# Altium schematic sheet PROC054D_Host_Connector.SchDoc: HOST_CONNECTOR
size 558 x 431 mm; Date: Not shown in title block; ApprovedBy: Not shown in title block; CheckedBy: Not shown in title block; Author: Not shown in title block; CompanyName: Not shown in title block; DrawnBy: a0271760; Engineer: Not shown in title block; Organization: Not shown in title block; Address1: Not shown in title block; Address2: Not shown in title block; Address3: Not shown in title block; Address4: Not shown in title block; DocumentNumber: 9; Revision: Use project pAWRameter SCH_Rev; SheetNumber: 9; SheetTotal: 19; PageSetup: Record=PageOptions|CenterHorizontal=True|CenterVertical=True|PrintScale=1.00|XCorrection=1.00|YCorrection=1.00|PrintKind=0|BorderSize=5000000|LeftOffset=0|BottomOffset=0|Orientation=2|PaperLength=1000|PaperWidth=1000|Scale=100|PaperSource=15|PrintQuality=600|MediaType=1|DitherType=10|PaperKind=Letter|PrintScaleMode=1; CurrentTime: Not shown in title block; CurrentDate: Not shown in title block; Time: Not shown in title block; DocumentFullPathAndName: Not shown in title block; DocumentName: Not shown in title block; ModifiedDate: Not shown in title block; ImagePath: Not shown in title block
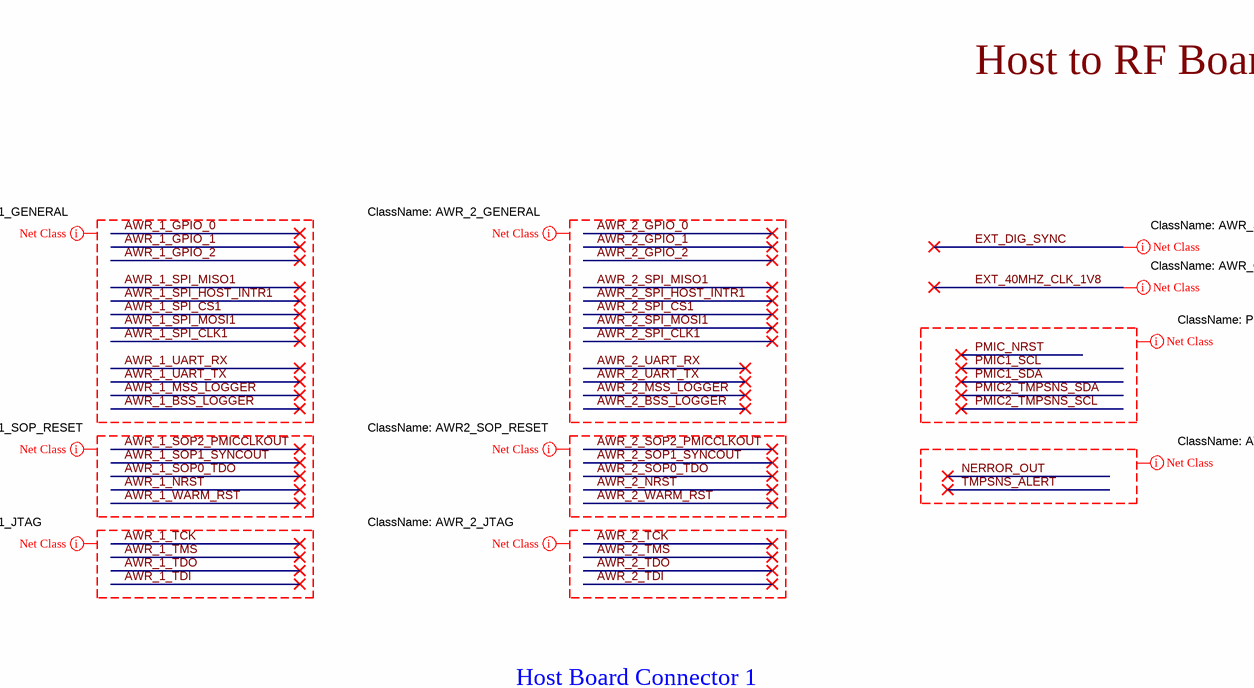
[diagram p0: PROC054D_Host_Connector.SchDoc, top left]
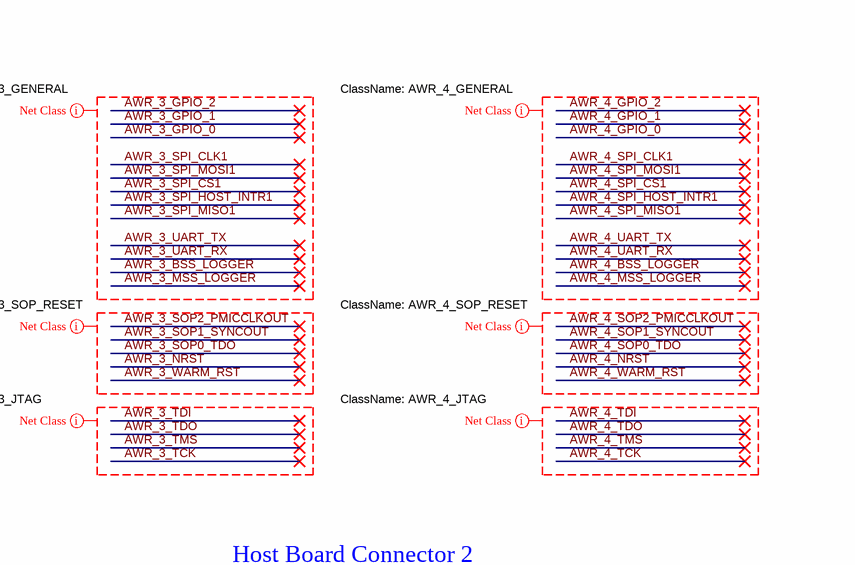
[diagram p1: PROC054D_Host_Connector.SchDoc, top right]
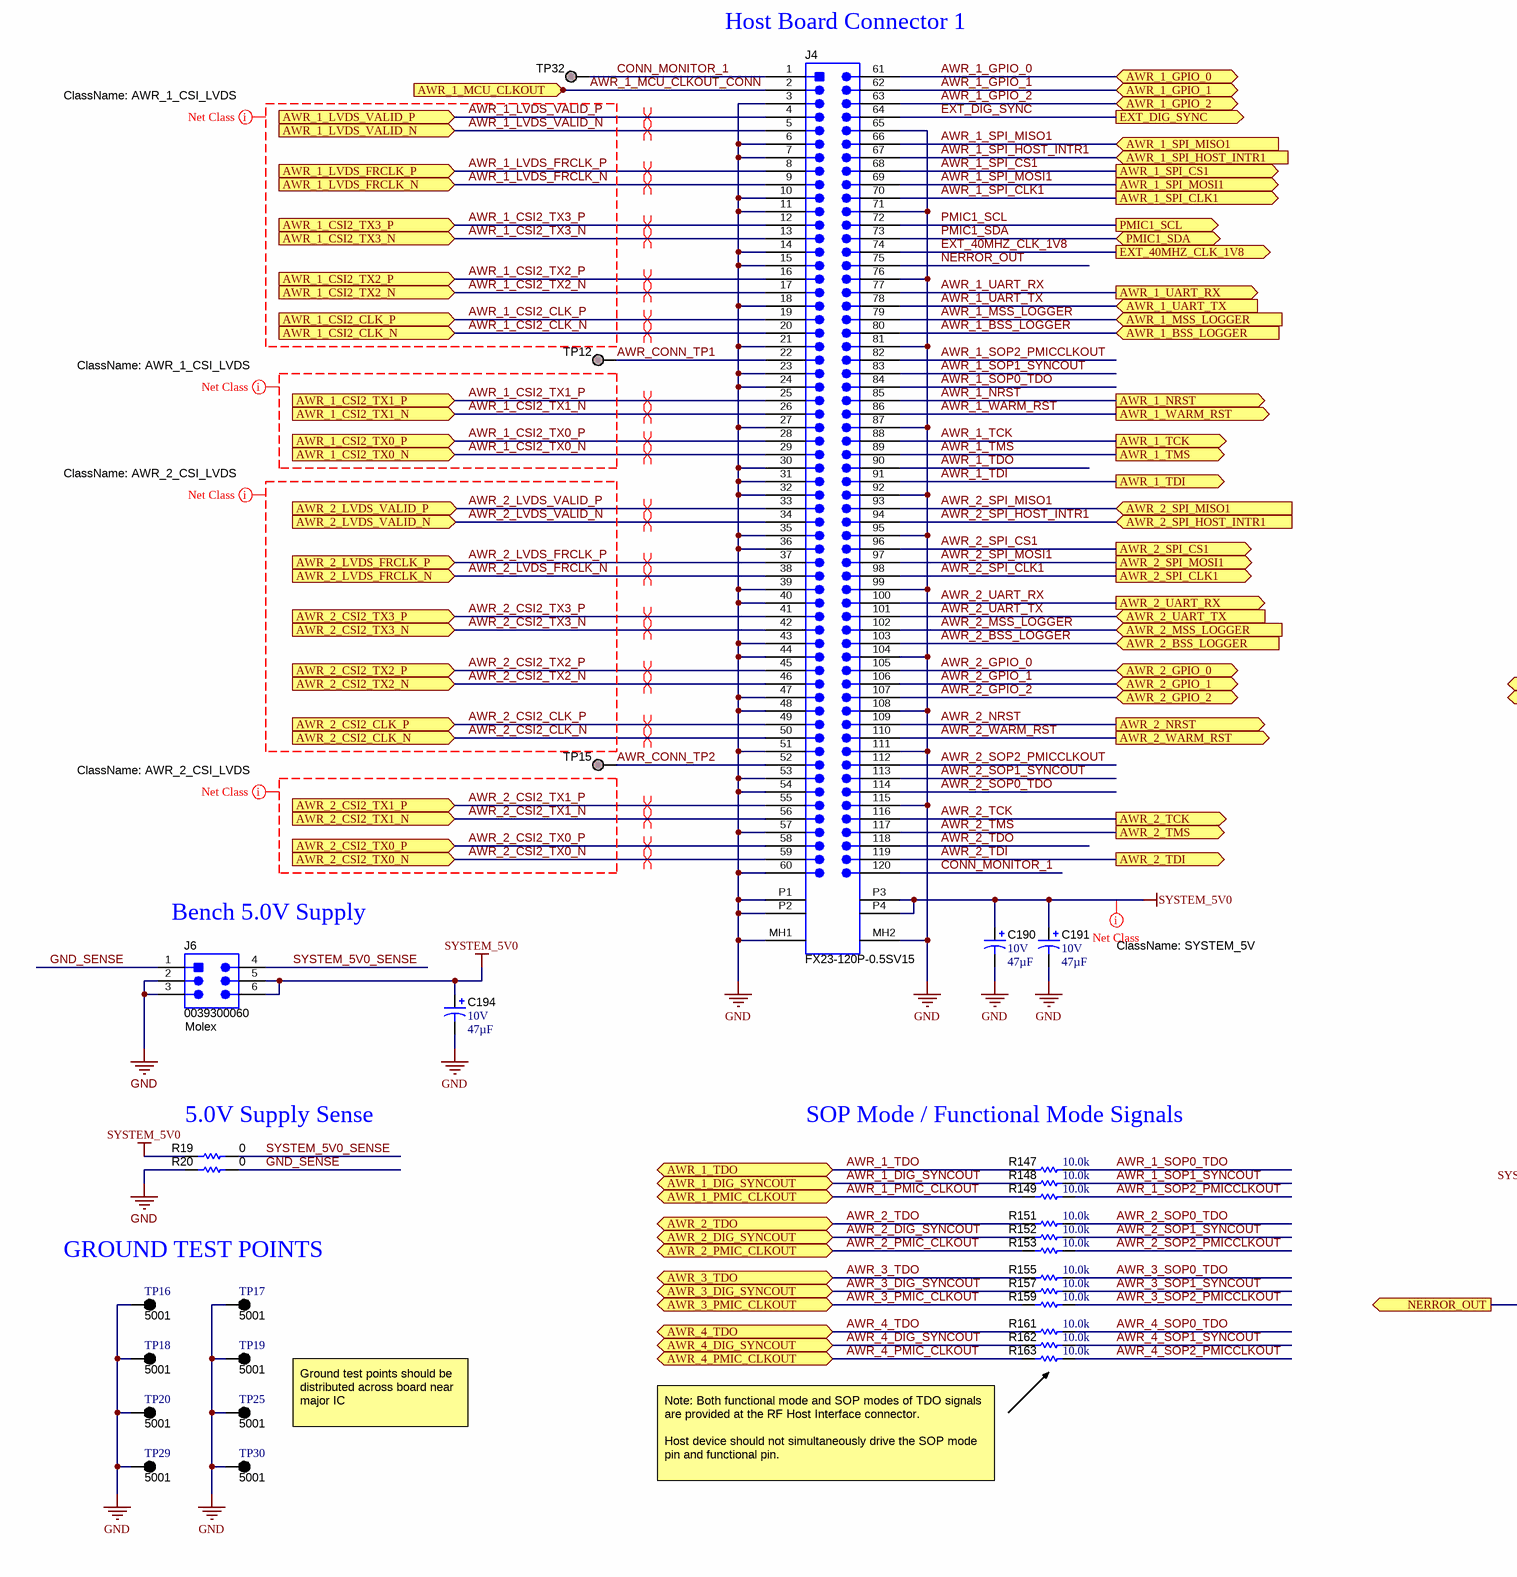
[diagram p2: PROC054D_Host_Connector.SchDoc, bottom left]
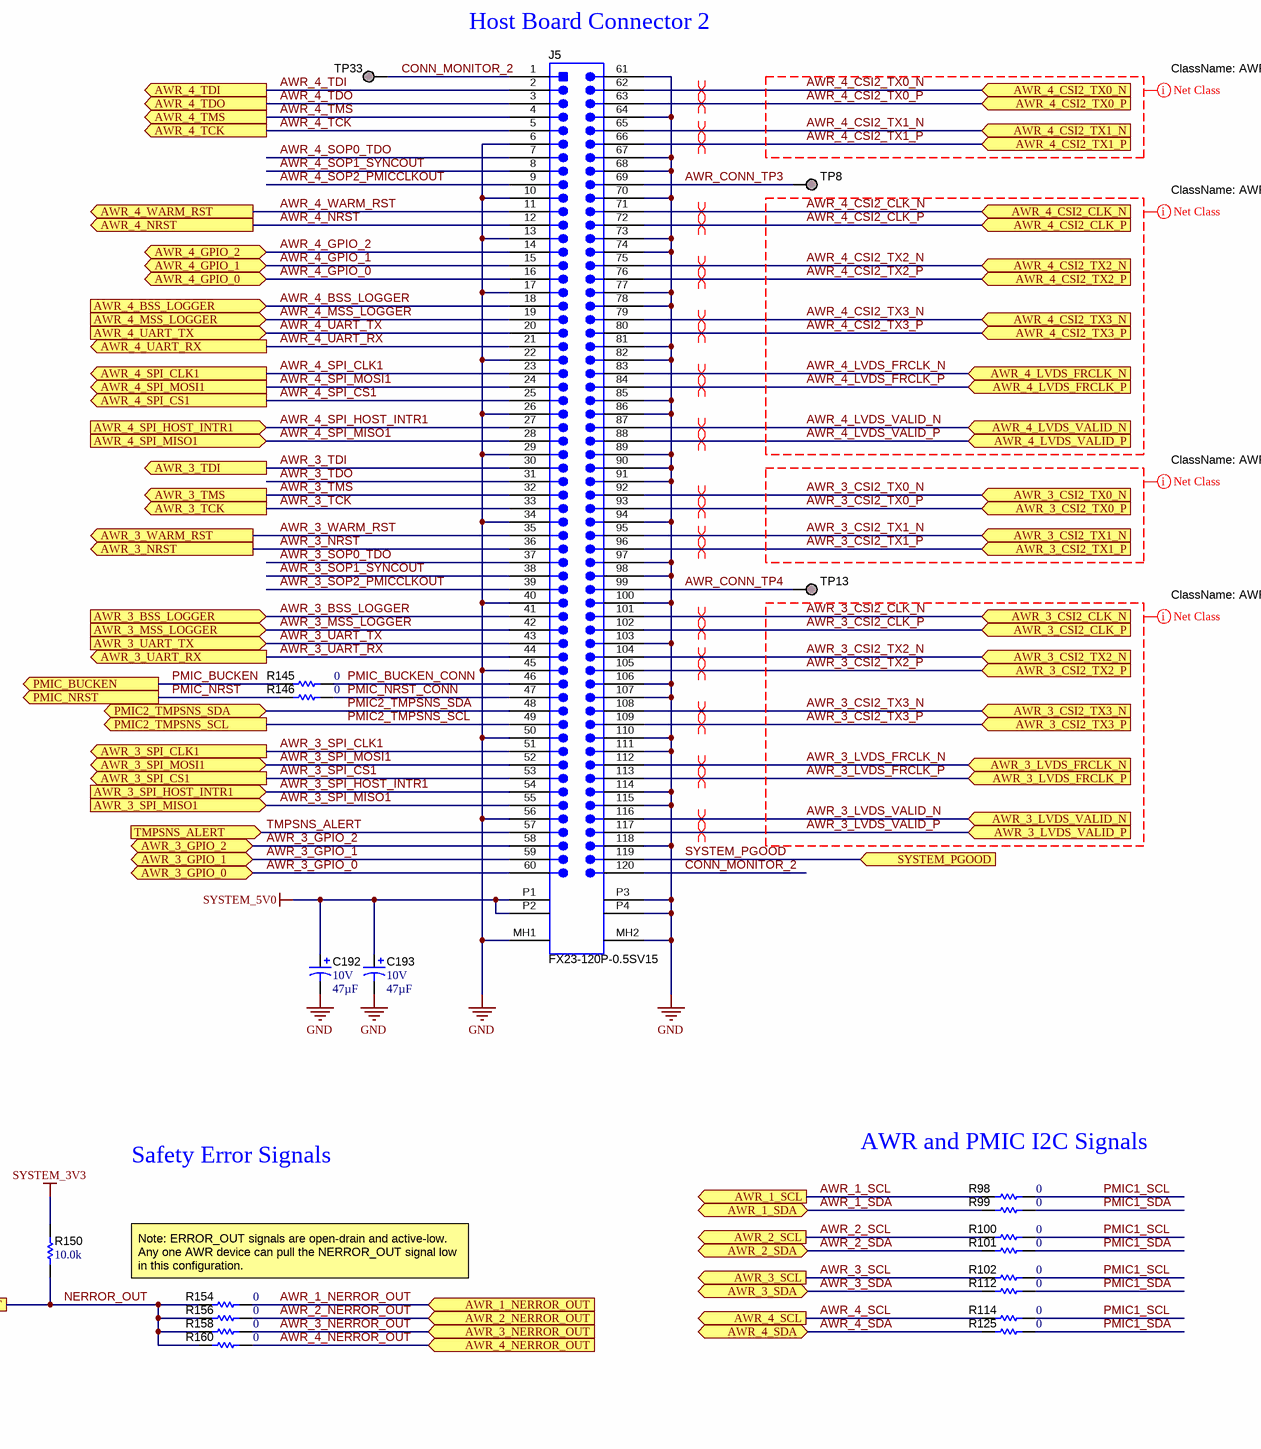
[diagram p3: PROC054D_Host_Connector.SchDoc, bottom right]

## Parts
C190  VDC_V: 10V  ValueDisplayed: 47µF  [3528-21]  (hidden comment: T491B476K010AT)
C191  VDC_V: 10V  ValueDisplayed: 47µF  [3528-21]  (hidden comment: T491B476K010AT)
C192  VDC_V: 10V  ValueDisplayed: 47µF  [3528-21]  (hidden comment: T491B476K010AT)
C193  VDC_V: 10V  ValueDisplayed: 47µF  [3528-21]  (hidden comment: T491B476K010AT)
C194  VDC_V: 10V  ValueDisplayed: 47µF  [3528-21]  (hidden comment: T491B476K010AT)
J4  FX23-120P-0.5SV15  [Hirose_FX23-120P-0_5SV15]
J5  FX23-120P-0.5SV15  [Hirose_FX23-120P-0_5SV15]
J6  0039300060  Manufacturer: Molex  [Molex_0039300060]
R19  ValueDisplayed: 0  [0805L]  (hidden comment: PMR10EZPJ000)
R20  ValueDisplayed: 0  [0805L]  (hidden comment: PMR10EZPJ000)
R98  ValueDisplayed: 0  [0402S]  (hidden comment: CRCW04020000Z0EDHP)
R99  ValueDisplayed: 0  [0402S]  (hidden comment: CRCW04020000Z0EDHP)
R100  ValueDisplayed: 0  [0402S]  (hidden comment: CRCW04020000Z0EDHP)
R101  ValueDisplayed: 0  [0402S]  (hidden comment: CRCW04020000Z0EDHP)
R102  ValueDisplayed: 0  [0402S]  (hidden comment: CRCW04020000Z0EDHP)
R112  ValueDisplayed: 0  [0402S]  (hidden comment: CRCW04020000Z0EDHP)
R114  ValueDisplayed: 0  [0402S]  (hidden comment: CRCW04020000Z0EDHP)
R125  ValueDisplayed: 0  [0402S]  (hidden comment: CRCW04020000Z0EDHP)
R145  ValueDisplayed: 0  [0402]  (hidden comment: ERJ-2GE0R00X)
R146  ValueDisplayed: 0  [0402]  (hidden comment: ERJ-2GE0R00X)
R147  ValueDisplayed: 10.0k  [0402]  (hidden comment: CRCW040210K0FKED)
R148  ValueDisplayed: 10.0k  [0402]  (hidden comment: CRCW040210K0FKED)
R149  ValueDisplayed: 10.0k  [0402]  (hidden comment: CRCW040210K0FKED)
R150  ValueDisplayed: 10.0k  [0402]  (hidden comment: CRCW040210K0FKED)
R151  ValueDisplayed: 10.0k  [0402]  (hidden comment: CRCW040210K0FKED)
R152  ValueDisplayed: 10.0k  [0402]  (hidden comment: CRCW040210K0FKED)
R153  ValueDisplayed: 10.0k  [0402]  (hidden comment: CRCW040210K0FKED)
R154  ValueDisplayed: 0  [0402S]  (hidden comment: CRCW04020000Z0EDHP)
R155  ValueDisplayed: 10.0k  [0402]  (hidden comment: CRCW040210K0FKED)
R156  ValueDisplayed: 0  [0402S]  (hidden comment: CRCW04020000Z0EDHP)
R157  ValueDisplayed: 10.0k  [0402]  (hidden comment: CRCW040210K0FKED)
R158  ValueDisplayed: 0  [0402S]  (hidden comment: CRCW04020000Z0EDHP)
R159  ValueDisplayed: 10.0k  [0402]  (hidden comment: CRCW040210K0FKED)
R160  ValueDisplayed: 0  [0402S]  (hidden comment: CRCW04020000Z0EDHP)
R161  ValueDisplayed: 10.0k  [0402]  (hidden comment: CRCW040210K0FKED)
R162  ValueDisplayed: 10.0k  [0402]  (hidden comment: CRCW040210K0FKED)
R163  ValueDisplayed: 10.0k  [0402]  (hidden comment: CRCW040210K0FKED)
TP8  TP_SM_1MM  [TP_SM_1MM]  (value not drawn)  (no BOM)
TP12  TP_SM_1MM  [TP_SM_1MM]  (value not drawn)  (no BOM)
TP13  TP_SM_1MM  [TP_SM_1MM]  (value not drawn)  (no BOM)
TP15  TP_SM_1MM  [TP_SM_1MM]  (value not drawn)  (no BOM)
TP16  5001  [Keystone5001]
TP17  5001  [Keystone5001]
TP18  5001  [Keystone5001]
TP19  5001  [Keystone5001]
TP20  5001  [Keystone5001]
TP25  5001  [Keystone5001]
TP29  5001  [Keystone5001]
TP30  5001  [Keystone5001]
TP32  TP_SM_1MM  [TP_SM_1MM]  (value not drawn)  (no BOM)
TP33  TP_SM_1MM  [TP_SM_1MM]  (value not drawn)  (no BOM)

## Ports
AWR_1_BSS_LOGGER (in), AWR_1_CSI2_CLK_N (in), AWR_1_CSI2_CLK_P (in), AWR_1_CSI2_TX0_N (in), AWR_1_CSI2_TX0_P (in), AWR_1_CSI2_TX1_N (in), AWR_1_CSI2_TX1_P (in), AWR_1_CSI2_TX2_N (in), AWR_1_CSI2_TX2_P (in), AWR_1_CSI2_TX3_N (in), AWR_1_CSI2_TX3_P (in), AWR_1_DIG_SYNCOUT (bidir), AWR_1_GPIO_0 (bidir), AWR_1_GPIO_1 (bidir), AWR_1_GPIO_2 (bidir), AWR_1_LVDS_FRCLK_N (in), AWR_1_LVDS_FRCLK_P (in), AWR_1_LVDS_VALID_N (in), AWR_1_LVDS_VALID_P (in), AWR_1_MCU_CLKOUT (in), AWR_1_MSS_LOGGER (in), AWR_1_NERROR_OUT (in), AWR_1_NRST (out), AWR_1_PMIC_CLKOUT (bidir), AWR_1_SCL (out), AWR_1_SDA (bidir), AWR_1_SPI_CLK1 (out), AWR_1_SPI_CS1 (out), AWR_1_SPI_HOST_INTR1 (in), AWR_1_SPI_MISO1 (in), AWR_1_SPI_MOSI1 (out), AWR_1_TCK (out), AWR_1_TDI (out), AWR_1_TDO (bidir), AWR_1_TMS (out), AWR_1_UART_RX (out), AWR_1_UART_TX (in), AWR_1_WARM_RST (out), AWR_2_BSS_LOGGER (in), AWR_2_CSI2_CLK_N (in), AWR_2_CSI2_CLK_P (in), AWR_2_CSI2_TX0_N (in), AWR_2_CSI2_TX0_P (in), AWR_2_CSI2_TX1_N (in), AWR_2_CSI2_TX1_P (in), AWR_2_CSI2_TX2_N (in), AWR_2_CSI2_TX2_P (in), AWR_2_CSI2_TX3_N (in), AWR_2_CSI2_TX3_P (in), AWR_2_DIG_SYNCOUT (bidir), AWR_2_GPIO_0 (bidir), AWR_2_GPIO_1 (bidir), AWR_2_GPIO_2 (bidir), AWR_2_LVDS_FRCLK_N (in), AWR_2_LVDS_FRCLK_P (in), AWR_2_LVDS_VALID_N (in), AWR_2_LVDS_VALID_P (in), AWR_2_MSS_LOGGER (in), AWR_2_NERROR_OUT (in), AWR_2_NRST (out), AWR_2_PMIC_CLKOUT (bidir), AWR_2_SCL (out), AWR_2_SDA (bidir), AWR_2_SPI_CLK1 (out), AWR_2_SPI_CS1 (out), AWR_2_SPI_HOST_INTR1 (in), AWR_2_SPI_MISO1 (in), AWR_2_SPI_MOSI1 (out), AWR_2_TCK (out), AWR_2_TDI (out), AWR_2_TDO (bidir), AWR_2_TMS (out), AWR_2_UART_RX (out), AWR_2_UART_TX (in), AWR_2_WARM_RST (out), AWR_3_BSS_LOGGER (in), AWR_3_CSI2_CLK_N (in), AWR_3_CSI2_CLK_P (in), AWR_3_CSI2_TX0_N (in), AWR_3_CSI2_TX0_P (in), AWR_3_CSI2_TX1_N (in), AWR_3_CSI2_TX1_P (in), AWR_3_CSI2_TX2_N (in), AWR_3_CSI2_TX2_P (in), AWR_3_CSI2_TX3_N (in), AWR_3_CSI2_TX3_P (in), AWR_3_DIG_SYNCOUT (bidir), AWR_3_GPIO_0 (bidir), AWR_3_GPIO_1 (bidir), AWR_3_GPIO_2 (bidir), AWR_3_LVDS_FRCLK_N (in), AWR_3_LVDS_FRCLK_P (in), AWR_3_LVDS_VALID_N (in), AWR_3_LVDS_VALID_P (in), AWR_3_MSS_LOGGER (in), AWR_3_NERROR_OUT (in), AWR_3_NRST (out), AWR_3_PMIC_CLKOUT (bidir), AWR_3_SCL (out), AWR_3_SDA (bidir), AWR_3_SPI_CLK1 (out), AWR_3_SPI_CS1 (out), AWR_3_SPI_HOST_INTR1 (in), AWR_3_SPI_MISO1 (in), AWR_3_SPI_MOSI1 (bidir), AWR_3_TCK (out), AWR_3_TDI (out), AWR_3_TDO (bidir), AWR_3_TMS (out), AWR_3_UART_RX (out), AWR_3_UART_TX (in), AWR_3_WARM_RST (out), AWR_4_BSS_LOGGER (in), AWR_4_CSI2_CLK_N (in), AWR_4_CSI2_CLK_P (in), AWR_4_CSI2_TX0_N (in), AWR_4_CSI2_TX0_P (in), AWR_4_CSI2_TX1_N (in), AWR_4_CSI2_TX1_P (in), AWR_4_CSI2_TX2_N (in), AWR_4_CSI2_TX2_P (in), AWR_4_CSI2_TX3_N (in), AWR_4_CSI2_TX3_P (in), AWR_4_DIG_SYNCOUT (bidir), AWR_4_GPIO_0 (bidir), AWR_4_GPIO_1 (bidir), AWR_4_GPIO_2 (bidir), AWR_4_LVDS_FRCLK_N (in), AWR_4_LVDS_FRCLK_P (in), AWR_4_LVDS_VALID_N (in), AWR_4_LVDS_VALID_P (in), AWR_4_MSS_LOGGER (in), AWR_4_NERROR_OUT (in), AWR_4_NRST (out), AWR_4_PMIC_CLKOUT (bidir), AWR_4_SCL (out), AWR_4_SDA (bidir), AWR_4_SPI_CLK1 (out), AWR_4_SPI_CS1 (out), AWR_4_SPI_HOST_INTR1 (in), AWR_4_SPI_MISO1 (in), AWR_4_SPI_MOSI1 (out), AWR_4_TCK (out), AWR_4_TDI (out), AWR_4_TDO (bidir), AWR_4_TDO (out), AWR_4_TMS (out), AWR_4_UART_RX (out), AWR_4_UART_TX (in), AWR_4_WARM_RST (out), EXT_40MHZ_CLK_1V8 (out), EXT_DIG_SYNC (out), NERROR_OUT (out), PMIC1_SCL (out), PMIC1_SDA (bidir), PMIC2_TMPSNS_SCL (out), PMIC2_TMPSNS_SDA (bidir), PMIC_BUCKEN (out), PMIC_NRST (out), SYSTEM_PGOOD (in), TMPSNS_ALERT (in)

## Nets
GND: C190.2(-) C191.2(-) C192.2(-) C193.2(-) C194.2(-) J4.3 J4.6 J4.7 J4.10 J4.11 J4.14 J4.15 J4.18 J4.21 J4.23 J4.24 J4.27 J4.30 J4.31 J4.32 J4.35 J4.36 J4.39 J4.40 J4.43 J4.44 J4.47 J4.48 J4.51 J4.53 J4.54 J4.57 J4.60 J4.65 J4.71 J4.76 J4.81 J4.87 J4.92 J4.95 J4.99 J4.104 J4.108 J4.111 J4.115 J4.MH1 J4.MH2 J4.P1 J4.P2 J5.6 J5.10 J5.13 J5.17 J5.22 J5.26 J5.29 J5.34 J5.40 J5.45 J5.50 J5.56 J5.61 J5.64 J5.67 J5.68 J5.70 J5.73 J5.74 J5.77 J5.78 J5.81 J5.82 J5.85 J5.86 J5.89 J5.90 J5.91 J5.94 J5.97 J5.98 J5.100 J5.103 J5.106 J5.107 J5.110 J5.111 J5.114 J5.115 J5.118 J5.MH1 J5.MH2 J5.P3 J5.P4 J6.2 J6.3 R20.1 TP16.1 TP17.1 TP18.1 TP19.1 TP20.1 TP25.1 TP29.1 TP30.1
SYSTEM_3V3: R150.2
SYSTEM_5V0: C190.1(+) C191.1(+) C192.1(+) C193.1(+) C194.1(+) J4.P3 J4.P4 J5.P1 J5.P2 J6.5 J6.6 R19.1
AWR_1_BSS_LOGGER: J4.80 ; port AWR_1_BSS_LOGGER
AWR_1_CSI2_CLK_N: J4.20 ; port AWR_1_CSI2_CLK_N
AWR_1_CSI2_CLK_P: J4.19 ; port AWR_1_CSI2_CLK_P
AWR_1_CSI2_TX0_N: J4.29 ; port AWR_1_CSI2_TX0_N
AWR_1_CSI2_TX0_P: J4.28 ; port AWR_1_CSI2_TX0_P
AWR_1_CSI2_TX1_N: J4.26 ; port AWR_1_CSI2_TX1_N
AWR_1_CSI2_TX1_P: J4.25 ; port AWR_1_CSI2_TX1_P
AWR_1_CSI2_TX2_N: J4.17 ; port AWR_1_CSI2_TX2_N
AWR_1_CSI2_TX2_P: J4.16 ; port AWR_1_CSI2_TX2_P
AWR_1_CSI2_TX3_N: J4.13 ; port AWR_1_CSI2_TX3_N
AWR_1_CSI2_TX3_P: J4.12 ; port AWR_1_CSI2_TX3_P
AWR_1_DIG_SYNCOUT: R148.1 ; port AWR_1_DIG_SYNCOUT
AWR_1_GPIO_0: J4.61 ; port AWR_1_GPIO_0
AWR_1_GPIO_1: J4.62 ; port AWR_1_GPIO_1
AWR_1_GPIO_2: J4.63 ; port AWR_1_GPIO_2
AWR_1_LVDS_FRCLK_N: J4.9 ; port AWR_1_LVDS_FRCLK_N
AWR_1_LVDS_FRCLK_P: J4.8 ; port AWR_1_LVDS_FRCLK_P
AWR_1_LVDS_VALID_N: J4.5 ; port AWR_1_LVDS_VALID_N
AWR_1_LVDS_VALID_P: J4.4 ; port AWR_1_LVDS_VALID_P
AWR_1_MCU_CLKOUT_CONN: J4.2 ; port AWR_1_MCU_CLKOUT
AWR_1_MSS_LOGGER: J4.79 ; port AWR_1_MSS_LOGGER
AWR_1_NERROR_OUT: R154.1 ; port AWR_1_NERROR_OUT
AWR_1_NRST: J4.85 ; port AWR_1_NRST
AWR_1_PMIC_CLKOUT: R149.1 ; port AWR_1_PMIC_CLKOUT
AWR_1_SCL: R98.2 ; port AWR_1_SCL
AWR_1_SDA: R99.2 ; port AWR_1_SDA
AWR_1_SOP0_TDO: J4.84 R147.2
AWR_1_SOP1_SYNCOUT: J4.83 R148.2
AWR_1_SOP2_PMICCLKOUT: J4.82 R149.2
AWR_1_SPI_CLK1: J4.70 ; port AWR_1_SPI_CLK1
AWR_1_SPI_CS1: J4.68 ; port AWR_1_SPI_CS1
AWR_1_SPI_HOST_INTR1: J4.67 ; port AWR_1_SPI_HOST_INTR1
AWR_1_SPI_MISO1: J4.66 ; port AWR_1_SPI_MISO1
AWR_1_SPI_MOSI1: J4.69 ; port AWR_1_SPI_MOSI1
AWR_1_TCK: J4.88 ; port AWR_1_TCK
AWR_1_TDI: J4.91 ; port AWR_1_TDI
AWR_1_TDO: J4.90 R147.1 ; port AWR_1_TDO
AWR_1_TMS: J4.89 ; port AWR_1_TMS
AWR_1_UART_RX: J4.77 ; port AWR_1_UART_RX
AWR_1_UART_TX: J4.78 ; port AWR_1_UART_TX
AWR_1_WARM_RST: J4.86 ; port AWR_1_WARM_RST
AWR_2_BSS_LOGGER: J4.103 ; port AWR_2_BSS_LOGGER
AWR_2_CSI2_CLK_N: J4.50 ; port AWR_2_CSI2_CLK_N
AWR_2_CSI2_CLK_P: J4.49 ; port AWR_2_CSI2_CLK_P
AWR_2_CSI2_TX0_N: J4.59 ; port AWR_2_CSI2_TX0_N
AWR_2_CSI2_TX0_P: J4.58 ; port AWR_2_CSI2_TX0_P
AWR_2_CSI2_TX1_N: J4.56 ; port AWR_2_CSI2_TX1_N
AWR_2_CSI2_TX1_P: J4.55 ; port AWR_2_CSI2_TX1_P
AWR_2_CSI2_TX2_N: J4.46 ; port AWR_2_CSI2_TX2_N
AWR_2_CSI2_TX2_P: J4.45 ; port AWR_2_CSI2_TX2_P
AWR_2_CSI2_TX3_N: J4.42 ; port AWR_2_CSI2_TX3_N
AWR_2_CSI2_TX3_P: J4.41 ; port AWR_2_CSI2_TX3_P
AWR_2_DIG_SYNCOUT: R152.1 ; port AWR_2_DIG_SYNCOUT
AWR_2_GPIO_0: J4.105 ; port AWR_2_GPIO_0
AWR_2_GPIO_1: J4.106 ; port AWR_2_GPIO_1
AWR_2_GPIO_2: J4.107 ; port AWR_2_GPIO_2
AWR_2_LVDS_FRCLK_N: J4.38 ; port AWR_2_LVDS_FRCLK_N
AWR_2_LVDS_FRCLK_P: J4.37 ; port AWR_2_LVDS_FRCLK_P
AWR_2_LVDS_VALID_N: J4.34 ; port AWR_2_LVDS_VALID_N
AWR_2_LVDS_VALID_P: J4.33 ; port AWR_2_LVDS_VALID_P
AWR_2_MSS_LOGGER: J4.102 ; port AWR_2_MSS_LOGGER
AWR_2_NERROR_OUT: R156.1 ; port AWR_2_NERROR_OUT
AWR_2_NRST: J4.109 ; port AWR_2_NRST
AWR_2_PMIC_CLKOUT: R153.1 ; port AWR_2_PMIC_CLKOUT
AWR_2_SCL: R100.2 ; port AWR_2_SCL
AWR_2_SDA: R101.2 ; port AWR_2_SDA
AWR_2_SOP0_TDO: J4.114 R151.2
AWR_2_SOP1_SYNCOUT: J4.113 R152.2
AWR_2_SOP2_PMICCLKOUT: J4.112 R153.2
AWR_2_SPI_CLK1: J4.98 ; port AWR_2_SPI_CLK1
AWR_2_SPI_CS1: J4.96 ; port AWR_2_SPI_CS1
AWR_2_SPI_HOST_INTR1: J4.94 ; port AWR_2_SPI_HOST_INTR1
AWR_2_SPI_MISO1: J4.93 ; port AWR_2_SPI_MISO1
AWR_2_SPI_MOSI1: J4.97 ; port AWR_2_SPI_MOSI1
AWR_2_TCK: J4.116 ; port AWR_2_TCK
AWR_2_TDI: J4.119 ; port AWR_2_TDI
AWR_2_TDO: J4.118 R151.1 ; port AWR_2_TDO
AWR_2_TMS: J4.117 ; port AWR_2_TMS
AWR_2_UART_RX: J4.100 ; port AWR_2_UART_RX
AWR_2_UART_TX: J4.101 ; port AWR_2_UART_TX
AWR_2_WARM_RST: J4.110 ; port AWR_2_WARM_RST
AWR_3_BSS_LOGGER: J5.41 ; port AWR_3_BSS_LOGGER
AWR_3_CSI2_CLK_N: J5.101 ; port AWR_3_CSI2_CLK_N
AWR_3_CSI2_CLK_P: J5.102 ; port AWR_3_CSI2_CLK_P
AWR_3_CSI2_TX0_N: J5.92 ; port AWR_3_CSI2_TX0_N
AWR_3_CSI2_TX0_P: J5.93 ; port AWR_3_CSI2_TX0_P
AWR_3_CSI2_TX1_N: J5.95 ; port AWR_3_CSI2_TX1_N
AWR_3_CSI2_TX1_P: J5.96 ; port AWR_3_CSI2_TX1_P
AWR_3_CSI2_TX2_N: J5.104 ; port AWR_3_CSI2_TX2_N
AWR_3_CSI2_TX2_P: J5.105 ; port AWR_3_CSI2_TX2_P
AWR_3_CSI2_TX3_N: J5.108 ; port AWR_3_CSI2_TX3_N
AWR_3_CSI2_TX3_P: J5.109 ; port AWR_3_CSI2_TX3_P
AWR_3_DIG_SYNCOUT: R157.1 ; port AWR_3_DIG_SYNCOUT
AWR_3_GPIO_0: J5.60 ; port AWR_3_GPIO_0
AWR_3_GPIO_1: J5.59 ; port AWR_3_GPIO_1
AWR_3_GPIO_2: J5.58 ; port AWR_3_GPIO_2
AWR_3_LVDS_FRCLK_N: J5.112 ; port AWR_3_LVDS_FRCLK_N
AWR_3_LVDS_FRCLK_P: J5.113 ; port AWR_3_LVDS_FRCLK_P
AWR_3_LVDS_VALID_N: J5.116 ; port AWR_3_LVDS_VALID_N
AWR_3_LVDS_VALID_P: J5.117 ; port AWR_3_LVDS_VALID_P
AWR_3_MSS_LOGGER: J5.42 ; port AWR_3_MSS_LOGGER
AWR_3_NERROR_OUT: R158.1 ; port AWR_3_NERROR_OUT
AWR_3_NRST: J5.36 ; port AWR_3_NRST
AWR_3_PMIC_CLKOUT: R159.1 ; port AWR_3_PMIC_CLKOUT
AWR_3_SCL: R102.2 ; port AWR_3_SCL
AWR_3_SDA: R112.2 ; port AWR_3_SDA
AWR_3_SOP0_TDO: J5.37 R155.2
AWR_3_SOP1_SYNCOUT: J5.38 R157.2
AWR_3_SOP2_PMICCLKOUT: J5.39 R159.2
AWR_3_SPI_CLK1: J5.51 ; port AWR_3_SPI_CLK1
AWR_3_SPI_CS1: J5.53 ; port AWR_3_SPI_CS1
AWR_3_SPI_HOST_INTR1: J5.54 ; port AWR_3_SPI_HOST_INTR1
AWR_3_SPI_MISO1: J5.55 ; port AWR_3_SPI_MISO1
AWR_3_SPI_MOSI1: J5.52 ; port AWR_3_SPI_MOSI1
AWR_3_TCK: J5.33 ; port AWR_3_TCK
AWR_3_TDI: J5.30 ; port AWR_3_TDI
AWR_3_TDO: J5.31 R155.1 ; port AWR_3_TDO
AWR_3_TMS: J5.32 ; port AWR_3_TMS
AWR_3_UART_RX: J5.44 ; port AWR_3_UART_RX
AWR_3_UART_TX: J5.43 ; port AWR_3_UART_TX
AWR_3_WARM_RST: J5.35 ; port AWR_3_WARM_RST
AWR_4_BSS_LOGGER: J5.18 ; port AWR_4_BSS_LOGGER
AWR_4_CSI2_CLK_N: J5.71 ; port AWR_4_CSI2_CLK_N
AWR_4_CSI2_CLK_P: J5.72 ; port AWR_4_CSI2_CLK_P
AWR_4_CSI2_TX0_N: J5.62 ; port AWR_4_CSI2_TX0_N
AWR_4_CSI2_TX0_P: J5.63 ; port AWR_4_CSI2_TX0_P
AWR_4_CSI2_TX1_N: J5.65 ; port AWR_4_CSI2_TX1_N
AWR_4_CSI2_TX1_P: J5.66 ; port AWR_4_CSI2_TX1_P
AWR_4_CSI2_TX2_N: J5.75 ; port AWR_4_CSI2_TX2_N
AWR_4_CSI2_TX2_P: J5.76 ; port AWR_4_CSI2_TX2_P
AWR_4_CSI2_TX3_N: J5.79 ; port AWR_4_CSI2_TX3_N
AWR_4_CSI2_TX3_P: J5.80 ; port AWR_4_CSI2_TX3_P
AWR_4_DIG_SYNCOUT: R162.1 ; port AWR_4_DIG_SYNCOUT
AWR_4_GPIO_0: J5.16 ; port AWR_4_GPIO_0
AWR_4_GPIO_1: J5.15 ; port AWR_4_GPIO_1
AWR_4_GPIO_2: J5.14 ; port AWR_4_GPIO_2
AWR_4_LVDS_FRCLK_N: J5.83 ; port AWR_4_LVDS_FRCLK_N
AWR_4_LVDS_FRCLK_P: J5.84 ; port AWR_4_LVDS_FRCLK_P
AWR_4_LVDS_VALID_N: J5.87 ; port AWR_4_LVDS_VALID_N
AWR_4_LVDS_VALID_P: J5.88 ; port AWR_4_LVDS_VALID_P
AWR_4_MSS_LOGGER: J5.19 ; port AWR_4_MSS_LOGGER
AWR_4_NERROR_OUT: R160.1 ; port AWR_4_NERROR_OUT
AWR_4_NRST: J5.12 ; port AWR_4_NRST
AWR_4_PMIC_CLKOUT: R163.1 ; port AWR_4_PMIC_CLKOUT
AWR_4_SCL: R114.2 ; port AWR_4_SCL
AWR_4_SDA: R125.2 ; port AWR_4_SDA
AWR_4_SOP0_TDO: J5.7 R161.2
AWR_4_SOP1_SYNCOUT: J5.8 R162.2
AWR_4_SOP2_PMICCLKOUT: J5.9 R163.2
AWR_4_SPI_CLK1: J5.23 ; port AWR_4_SPI_CLK1
AWR_4_SPI_CS1: J5.25 ; port AWR_4_SPI_CS1
AWR_4_SPI_HOST_INTR1: J5.27 ; port AWR_4_SPI_HOST_INTR1
AWR_4_SPI_MISO1: J5.28 ; port AWR_4_SPI_MISO1
AWR_4_SPI_MOSI1: J5.24 ; port AWR_4_SPI_MOSI1
AWR_4_TCK: J5.5 ; port AWR_4_TCK
AWR_4_TDI: J5.2 ; port AWR_4_TDI
AWR_4_TDO: J5.3 R161.1 ; port AWR_4_TDO
AWR_4_TMS: J5.4 ; port AWR_4_TMS
AWR_4_UART_RX: J5.21 ; port AWR_4_UART_RX
AWR_4_UART_TX: J5.20 ; port AWR_4_UART_TX
AWR_4_WARM_RST: J5.11 ; port AWR_4_WARM_RST
AWR_CONN_TP1: J4.22 TP12.1
AWR_CONN_TP2: J4.52 TP15.1
AWR_CONN_TP3: J5.69 TP8.1
AWR_CONN_TP4: J5.99 TP13.1
CONN_MONITOR_1: J4.1 J4.120 TP32.1
CONN_MONITOR_2: J5.1 J5.120 TP33.1
EXT_40MHZ_CLK_1V8: J4.74 ; port EXT_40MHZ_CLK_1V8
EXT_DIG_SYNC: J4.64 ; port EXT_DIG_SYNC
GND_SENSE: J6.1 R20.2
NERROR_OUT: J4.75 R150.1 R154.2 R156.2 R158.2 R160.2 ; port NERROR_OUT
PMIC1_SCL: J4.72 R98.1 R100.1 R102.1 R114.1 ; port PMIC1_SCL
PMIC1_SDA: J4.73 R99.1 R101.1 R112.1 R125.1 ; port PMIC1_SDA
PMIC2_TMPSNS_SCL: J5.49 ; port PMIC2_TMPSNS_SCL
PMIC2_TMPSNS_SDA: J5.48 ; port PMIC2_TMPSNS_SDA
PMIC_BUCKEN: R145.1 ; port PMIC_BUCKEN
PMIC_BUCKEN_CONN: J5.46 R145.2
PMIC_NRST: R146.1 ; port PMIC_NRST
PMIC_NRST_CONN: J5.47 R146.2
SYSTEM_5V0_SENSE: J6.4 R19.2
SYSTEM_PGOOD: J5.119 ; port SYSTEM_PGOOD
TMPSNS_ALERT: J5.57 ; port TMPSNS_ALERT

## Layout directives
net class AWR_1_CSI_LVDS: AWR_1_CSI2_CLK_N, AWR_1_CSI2_CLK_P, AWR_1_CSI2_TX0_N, AWR_1_CSI2_TX0_P, AWR_1_CSI2_TX1_N, AWR_1_CSI2_TX1_P, AWR_1_CSI2_TX2_N, AWR_1_CSI2_TX2_P, AWR_1_CSI2_TX3_N, AWR_1_CSI2_TX3_P, AWR_1_LVDS_FRCLK_N, AWR_1_LVDS_FRCLK_P, AWR_1_LVDS_VALID_N, AWR_1_LVDS_VALID_P
net class AWR_2_CSI_LVDS: AWR_2_CSI2_CLK_N, AWR_2_CSI2_CLK_P, AWR_2_CSI2_TX0_N, AWR_2_CSI2_TX0_P, AWR_2_CSI2_TX1_N, AWR_2_CSI2_TX1_P, AWR_2_CSI2_TX2_N, AWR_2_CSI2_TX2_P, AWR_2_CSI2_TX3_N, AWR_2_CSI2_TX3_P, AWR_2_LVDS_FRCLK_N, AWR_2_LVDS_FRCLK_P, AWR_2_LVDS_VALID_N, AWR_2_LVDS_VALID_P
net class AWR_1_GENERAL: AWR_1_BSS_LOGGER, AWR_1_GPIO_0, AWR_1_GPIO_1, AWR_1_GPIO_2, AWR_1_MSS_LOGGER, AWR_1_SPI_CLK1, AWR_1_SPI_CS1, AWR_1_SPI_HOST_INTR1, AWR_1_SPI_MISO1, AWR_1_SPI_MOSI1, AWR_1_UART_RX, AWR_1_UART_TX
net class AWR_1_SOP_RESET: AWR_1_NRST, AWR_1_SOP0_TDO, AWR_1_SOP1_SYNCOUT, AWR_1_SOP2_PMICCLKOUT, AWR_1_WARM_RST
net class AWR_1_JTAG: AWR_1_TCK, AWR_1_TDI, AWR_1_TDO, AWR_1_TMS
net class AWR_SYNC: EXT_DIG_SYNC
net class PMIC_CONTROL: PMIC1_SCL, PMIC1_SDA, PMIC2_TMPSNS_SCL, PMIC2_TMPSNS_SDA, PMIC_NRST
net class AWR_SAFETY: NERROR_OUT, TMPSNS_ALERT
net class AWR_2_JTAG: AWR_2_TCK, AWR_2_TDI, AWR_2_TDO, AWR_2_TMS
net class AWR2_SOP_RESET: AWR_2_NRST, AWR_2_SOP0_TDO, AWR_2_SOP1_SYNCOUT, AWR_2_SOP2_PMICCLKOUT, AWR_2_WARM_RST
net class AWR_2_GENERAL: AWR_2_BSS_LOGGER, AWR_2_GPIO_0, AWR_2_GPIO_1, AWR_2_GPIO_2, AWR_2_MSS_LOGGER, AWR_2_SPI_CLK1, AWR_2_SPI_CS1, AWR_2_SPI_HOST_INTR1, AWR_2_SPI_MISO1, AWR_2_SPI_MOSI1, AWR_2_UART_RX, AWR_2_UART_TX
differential pair: AWR_1_CSI2_CLK_N, AWR_1_CSI2_CLK_P, AWR_1_CSI2_TX0_N, AWR_1_CSI2_TX0_P, AWR_1_CSI2_TX1_N, AWR_1_CSI2_TX1_P, AWR_1_CSI2_TX2_N, AWR_1_CSI2_TX2_P, AWR_1_CSI2_TX3_N, AWR_1_CSI2_TX3_P, AWR_1_LVDS_FRCLK_N, AWR_1_LVDS_FRCLK_P, AWR_1_LVDS_VALID_N, AWR_1_LVDS_VALID_P, AWR_2_CSI2_CLK_N, AWR_2_CSI2_CLK_P, AWR_2_CSI2_TX0_N, AWR_2_CSI2_TX0_P, AWR_2_CSI2_TX1_N, AWR_2_CSI2_TX1_P, AWR_2_CSI2_TX2_N, AWR_2_CSI2_TX2_P, AWR_2_CSI2_TX3_N, AWR_2_CSI2_TX3_P, AWR_2_LVDS_FRCLK_N, AWR_2_LVDS_FRCLK_P, AWR_2_LVDS_VALID_N, AWR_2_LVDS_VALID_P, AWR_3_CSI2_CLK_N, AWR_3_CSI2_CLK_P, AWR_3_CSI2_TX0_N, AWR_3_CSI2_TX0_P, AWR_3_CSI2_TX1_N, AWR_3_CSI2_TX1_P, AWR_3_CSI2_TX2_N, AWR_3_CSI2_TX2_P, AWR_3_CSI2_TX3_N, AWR_3_CSI2_TX3_P, AWR_3_LVDS_FRCLK_N, AWR_3_LVDS_FRCLK_P, AWR_3_LVDS_VALID_N, AWR_3_LVDS_VALID_P, AWR_4_CSI2_CLK_N, AWR_4_CSI2_CLK_P, AWR_4_CSI2_TX0_N, AWR_4_CSI2_TX0_P, AWR_4_CSI2_TX1_N, AWR_4_CSI2_TX1_P, AWR_4_CSI2_TX2_N, AWR_4_CSI2_TX2_P, AWR_4_CSI2_TX3_N, AWR_4_CSI2_TX3_P, AWR_4_LVDS_FRCLK_N, AWR_4_LVDS_FRCLK_P, AWR_4_LVDS_VALID_N, AWR_4_LVDS_VALID_P
net class AWR_4_CSI_LVDS: AWR_4_CSI2_CLK_N, AWR_4_CSI2_CLK_P, AWR_4_CSI2_TX0_N, AWR_4_CSI2_TX0_P, AWR_4_CSI2_TX1_N, AWR_4_CSI2_TX1_P, AWR_4_CSI2_TX2_N, AWR_4_CSI2_TX2_P, AWR_4_CSI2_TX3_N, AWR_4_CSI2_TX3_P, AWR_4_LVDS_FRCLK_N, AWR_4_LVDS_FRCLK_P, AWR_4_LVDS_VALID_N, AWR_4_LVDS_VALID_P
net class AWR_3_CSI_LVDS: AWR_3_CSI2_CLK_N, AWR_3_CSI2_CLK_P, AWR_3_CSI2_TX0_N, AWR_3_CSI2_TX0_P, AWR_3_CSI2_TX1_N, AWR_3_CSI2_TX1_P, AWR_3_CSI2_TX2_N, AWR_3_CSI2_TX2_P, AWR_3_CSI2_TX3_N, AWR_3_CSI2_TX3_P, AWR_3_LVDS_FRCLK_N, AWR_3_LVDS_FRCLK_P, AWR_3_LVDS_VALID_N, AWR_3_LVDS_VALID_P
net class AWR_3_JTAG: AWR_3_TCK, AWR_3_TDI, AWR_3_TDO, AWR_3_TMS
net class AWR_3_SOP_RESET: AWR_3_NRST, AWR_3_SOP0_TDO, AWR_3_SOP1_SYNCOUT, AWR_3_SOP2_PMICCLKOUT, AWR_3_WARM_RST
net class AWR_3_GENERAL: AWR_3_BSS_LOGGER, AWR_3_GPIO_0, AWR_3_GPIO_1, AWR_3_GPIO_2, AWR_3_MSS_LOGGER, AWR_3_SPI_CLK1, AWR_3_SPI_CS1, AWR_3_SPI_HOST_INTR1, AWR_3_SPI_MISO1, AWR_3_SPI_MOSI1, AWR_3_UART_RX, AWR_3_UART_TX
net class AWR_4_JTAG: AWR_4_TCK, AWR_4_TDI, AWR_4_TDO, AWR_4_TMS
net class AWR_4_SOP_RESET: AWR_4_NRST, AWR_4_SOP0_TDO, AWR_4_SOP1_SYNCOUT, AWR_4_SOP2_PMICCLKOUT, AWR_4_WARM_RST
net class AWR_4_GENERAL: AWR_4_BSS_LOGGER, AWR_4_GPIO_0, AWR_4_GPIO_1, AWR_4_GPIO_2, AWR_4_MSS_LOGGER, AWR_4_SPI_CLK1, AWR_4_SPI_CS1, AWR_4_SPI_HOST_INTR1, AWR_4_SPI_MISO1, AWR_4_SPI_MOSI1, AWR_4_UART_RX, AWR_4_UART_TX
net class AWR_CLOCK: EXT_40MHZ_CLK_1V8
net class SYSTEM_5V: SYSTEM_5V0

## Notes on the sheet
- Host to RF Board Connectors
- (near J4) Host Board Connector 1
- (near J5) Host Board Connector 2
- (near J6) Bench 5.0V Supply
- 5.0V Supply Sense
- SOP Mode / Functional Mode Signals
- Safety Error Signals
- AWR and PMIC I2C Signals
- GROUND TEST POINTS
- Note: ERROR_OUT signals are open-drain and active-low. Any one AWR device can pull the NERROR_OUT signal low in this configuration.
- Ground test points should be distributed across board near major IC
- Note: Both functional mode and SOP modes of TDO signals are provided at the RF Host Interface connector.
  Host device should not simultaneously drive the SOP mode pin and functional pin.
- Drawn By:
- SVN Rev:
- Number:
- TID #:
- Orderable:
- Rev:
- Sheet Title:
- File:
- Project Title:
- Designed for:
- Assembly VAWRiant:
- Mod. Date:
- Sheet:
- Size:
- of
- C
- http://www.ti.com
- Texas Instruments and/or its licensors do not wAWRrant the accuracy or completeness of this specification or any information contained therein. Texas Instruments and/or its licensors do not wAWRrant that this design will meet the specifications, will be suitable for your application or fit for any pAWRticulAWR purpose, or will operate in an implementation. Texas Instruments and/or its licensors do not wAWRrant that the design is production worthy. You should completely validate and test your design implementation to confirm the system functionality for your application.
- Engineer:
- Contact:
- © Texas Instruments

## Library data of the parts
C190-C194 = CMP-0078216-1: CAP, TA, 47 µF, 10 V, +/- 10%, SMD; Manufacturer: Kemet; TaMin_C: -55°C; Polarized: Y; SizeAreaWB_mm2: 17.1; Value: 47uF; TaMax_C: 125°C; SizeZ_mm: 2.1; SizeX_mm: 3.5; SizeY_mm: 2.8; SizeArea_mm2: 9.8; CompType: Capacitor; AEC Qualified: N; AEC Category: Q200; ComponentLink1URL: https://content.kemet.com/datasheets/KEM_T2005_T491.pdf; Supplier Part Number 2: 57K1819; Supplier 2: Newark; Supplier Part Number 3: 80-T491B476K010; Supplier 3: Mouser; RoHS: Y; MountType: SMT; Supplier 1: Digi-Key; PackageReference: 3528-21; Tolerance_%: 10%; Cap_Case: 3528-21; Value2: 10V; PartNumber: T491B476K010AT; Series: T491; Cap_F: 47µF; ComponentLink1Description: Datasheet link; AEC Grade: N/A; Supplier Part Number 1: 399-9728-1-ND; Technology: TA
J4 J5 = CMP-0081853-1: Header(shrouded), 0.5mm, 60x2, Gold, SMT; Manufacturer: Hirose Electric Co. Ltd.; Pitch_mm: 0.5; Gender: Male; Cert_UL: Y; Row_Count: 2; ComponentLink1Description: Datasheet URL; RoHS: Y; Supplier 1: Digi-Key; Orientation: Vertical; PackageReference: Header(shrouded), 0.5mm, 60x2, SMT; Color: Black; PartNumber: FX23-120P-0.5SV15; PinCount: 120; Supplier Part Number 2: 798-FX23-120P0.5SV15; ContactFinish: Gold; Supplier 2: Mouser; Shrouded: Y; ComponentLink1URL: https://www.hirose.com/product/en/download_file/key_name/FX23-120P-0.5SV15/category/Drawing%20(2D)/doc_file_id/41859/?file_category_id=6&item_id=05733006400&is_series=; CompType: Header; Supplier Part Number 1: H125039-ND; MountType: SMT
J6 = CMP-0082107-1: Header(shrouded), 4.2mm, 3x2, Tin, R/A, TH; Pitch_mm: 4.2; Gender: Male; Cert_CSA: Y; Voltage_V: 600V; Current_A: 13A; Row_Count: 2; ComponentLink1Description: Datasheet URL; RoHS: Y; Supplier Part Number 3: 538-39-30-0060; Supplier 1: Digi-Key; Cert_UL: Y; Orientation: R/A; PackageReference: Header(shrouded), 4.2mm, 3x2, R/A, TH; Color: Natural; PartNumber: 0039300060; PinCount: 6; Supplier Part Number 2: 08R6102; ContactFinish: Tin; Supplier 2: Newark; Shrouded: Y; RowSpacing_mm: 4.2; ComponentLink1URL: https://www.molex.com/pdm_docs/sd/039300060_sd.pdf; CompType: Header; MountType: TH; Supplier Part Number 1: WM21353-ND; Supplier 3: Mouser
R19 R20 = CMP-0081857-1: RES, 0, 0%,  W, AEC-Q200 Grade 0, 0805; Manufacturer: Rohm; SizeAreaWB_mm2: 6.75; SizeArea_mm2: 2.5; AEC Qualified: Y; AEC Category: Q200; Value: 0; SizeZ_mm: 1.45; SizeY_mm: 1.25; CompType: Resistor; SizeX_mm: 2; ComponentLink1Description: Datasheet link; RoHS: Y; Tolerance_%: 0%; Value_Code: 0; Supplier 1: Mouser; PackageReference: 0805; Technology: Thick Film; Res_ohm: 0; PartNumber: PMR10EZPJ000; AEC Grade: 0; Value2: W; ComponentLink1URL: http://www.rohm.com/web/global/datasheet/PMR10EZPJ000/pmr-jpw-e; Value1: 0%; MountType: SMT; Supplier Part Number 1: 755-PMR10EZPJ000
R98-R102 R112 R114 R125 R154 R156 R158 R160 = CMP-0081856-1: RES, 0, 0%, 0.2 W, AEC-Q200 Grade 0, 0402; Manufacturer: Vishay-Dale; SizeAreaWB_mm2: 3; SizeArea_mm2: 0.5; AEC Qualified: Y; AEC Category: Q200; Value: 0; SizeZ_mm: 0.6; Power_W: 200mW; VDC_V: 50V; Value2: 0.2W; CompType: Resistor; SizeX_mm: 1; ComponentLink1Description: Datasheet link; RoHS: Y; Supplier Part Number 3: 71-CRCW04020000Z0EDH; Tolerance_%: 0%; Value_Code: 0; Supplier 1: Digi-Key; PackageReference: 0402; Technology: Thick Film; Res_ohm: 0; PartNumber: CRCW04020000Z0EDHP; Supplier Part Number 2: 96Y9050; Supplier 2: Newark; AEC Grade: 0; SizeY_mm: 0.5; ComponentLink1URL: http://www.vishay.com/docs/20043/crcwhpe3.pdf; Value1: 0%; MountType: SMT; Supplier Part Number 1: 541-0.0YBTR-ND; Supplier 3: Mouser
R145 R146 = CMP-0026992-3: RES, 0, 5%, 0.1 W, AEC-Q200 Grade 0, 0402; Manufacturer: Panasonic; Power_W: 100mW; TempCo: 600 ppm/C; Value_Code: 0000; Value: 0; EIA_Code: E24; SizeX_mm: 1; SizeY_mm: 0.5; SizeZ_mm: 0.6; Value2: 0.1W; AEC Qualified: Y; VDC_V: 50V; AEC Category: Q200; SizeAreaWB_mm2: 3; Supplier Part Number 2: 65T8307; Supplier 2: Newark; Supplier Part Number 3: 667-ERJ-2GE0R00X; Supplier 3: Mouser; RoHS: Y; Value1: 5%; MountType: SMT; Supplier 1: Digi-Key; PackageReference: 0402; Tolerance_%: 5%; Res_ohm: 0; SizeArea_mm2: 0.5; CompType: Resistor; PartNumber: ERJ-2GE0R00X; ComponentLink1Description: Datasheet link; Supplier Part Number 1: P0.0JCT-ND; Technology: Thick Film; ComponentLink1URL: https://industrial.panasonic.com/cdbs/www-data/pdf/RDA0000/AOA0000C301.pdf; AEC Grade: 0
R147-R153 R155 R157 R159 R161-R163 = CMP-0025958-3: RES, 10.0 k, 1%, 0.063 W, AEC-Q200 Grade 0, 0402; Manufacturer: Vishay-Dale; Power_W: 63mW; TempCo: 100 ppm/C; Value_Code: 10k0; Value: 10.0k; EIA_Code: E96; Res_ohm: 10k; SizeX_mm: 1; SizeY_mm: 0.5; SizeZ_mm: 0.6; Value2: 0.063W; AEC Qualified: Y; VDC_V: 50V; AEC Category: Q200; AEC Grade: 0; Supplier Part Number 2: 52K6595; Supplier 2: Newark; Supplier Part Number 3: 71-CRCW0402-10K-E3; Supplier 3: Mouser; RoHS: E; Value1: 1%; MountType: SMT; Supplier 1: Digi-Key; PackageReference: 0402; Tolerance_%: 1%; SizeArea_mm2: 0.5; CompType: Resistor; PartNumber: CRCW040210K0FKED; ComponentLink1Description: Datasheet link; Supplier Part Number 1: 541-10.0KLCT-ND; Technology: Thick Film; ComponentLink1URL: http://www.vishay.com/docs/20035/dcrcwe3.pdf
TP8 TP12 TP13 TP15 TP32 TP33 = CMP-0003825-1: 1mm Test Point, SMT; Manufacturer: Any; CompType: Test Point; PackageReference: 1mm Test Point, SMT; Publisher: Texas Instruments; LatestRevisionDate: 2017-03-09; ComponentLink1Description: Datasheet Link; ComponentLink1URL: https://sps06.itg.ti.com/sites/KMS/crossdivteams/altium/docs/ComponentDatasheets/PROBE_TEST_POINT.png; Key: TP_SM_1MM; MountType: SMT; PartNumber: TP_SM_1MM
TP16-TP20 TP25 TP29 TP30 = CMP-0055138-1: Test Point, Miniature, Black, TH; Manufacturer: Keystone; ContactFinish: Silver; Green_Lifecycle: Active; Green_REACh: Passed; CNHeader: FALSE; CT: TRUE; PartNumber: 5001; PackageReference: Black Miniature Testpoint; CompType: Test Point; RoHS: Y; MountType: TH; ComponentLink1Description: Datasheet URL; ComponentLink1URL: http://www.keyelco.com/userAssets/file/M60-2p60.pdf; Color: Black; Publisher: Texas Instruments; LatestRevisionDate: 26/05/2017; Supplier 1: Digi-Key; Supplier Part Number 1: 36-5001-ND; Supplier 2: Mouser; Supplier Part Number 2: 534-5001; Green_EU RoHS: Passed; Green_EU RoHS-2: Incomplete